# EAGLE design 10_ARDUINO (EAGLE 7.6.0)
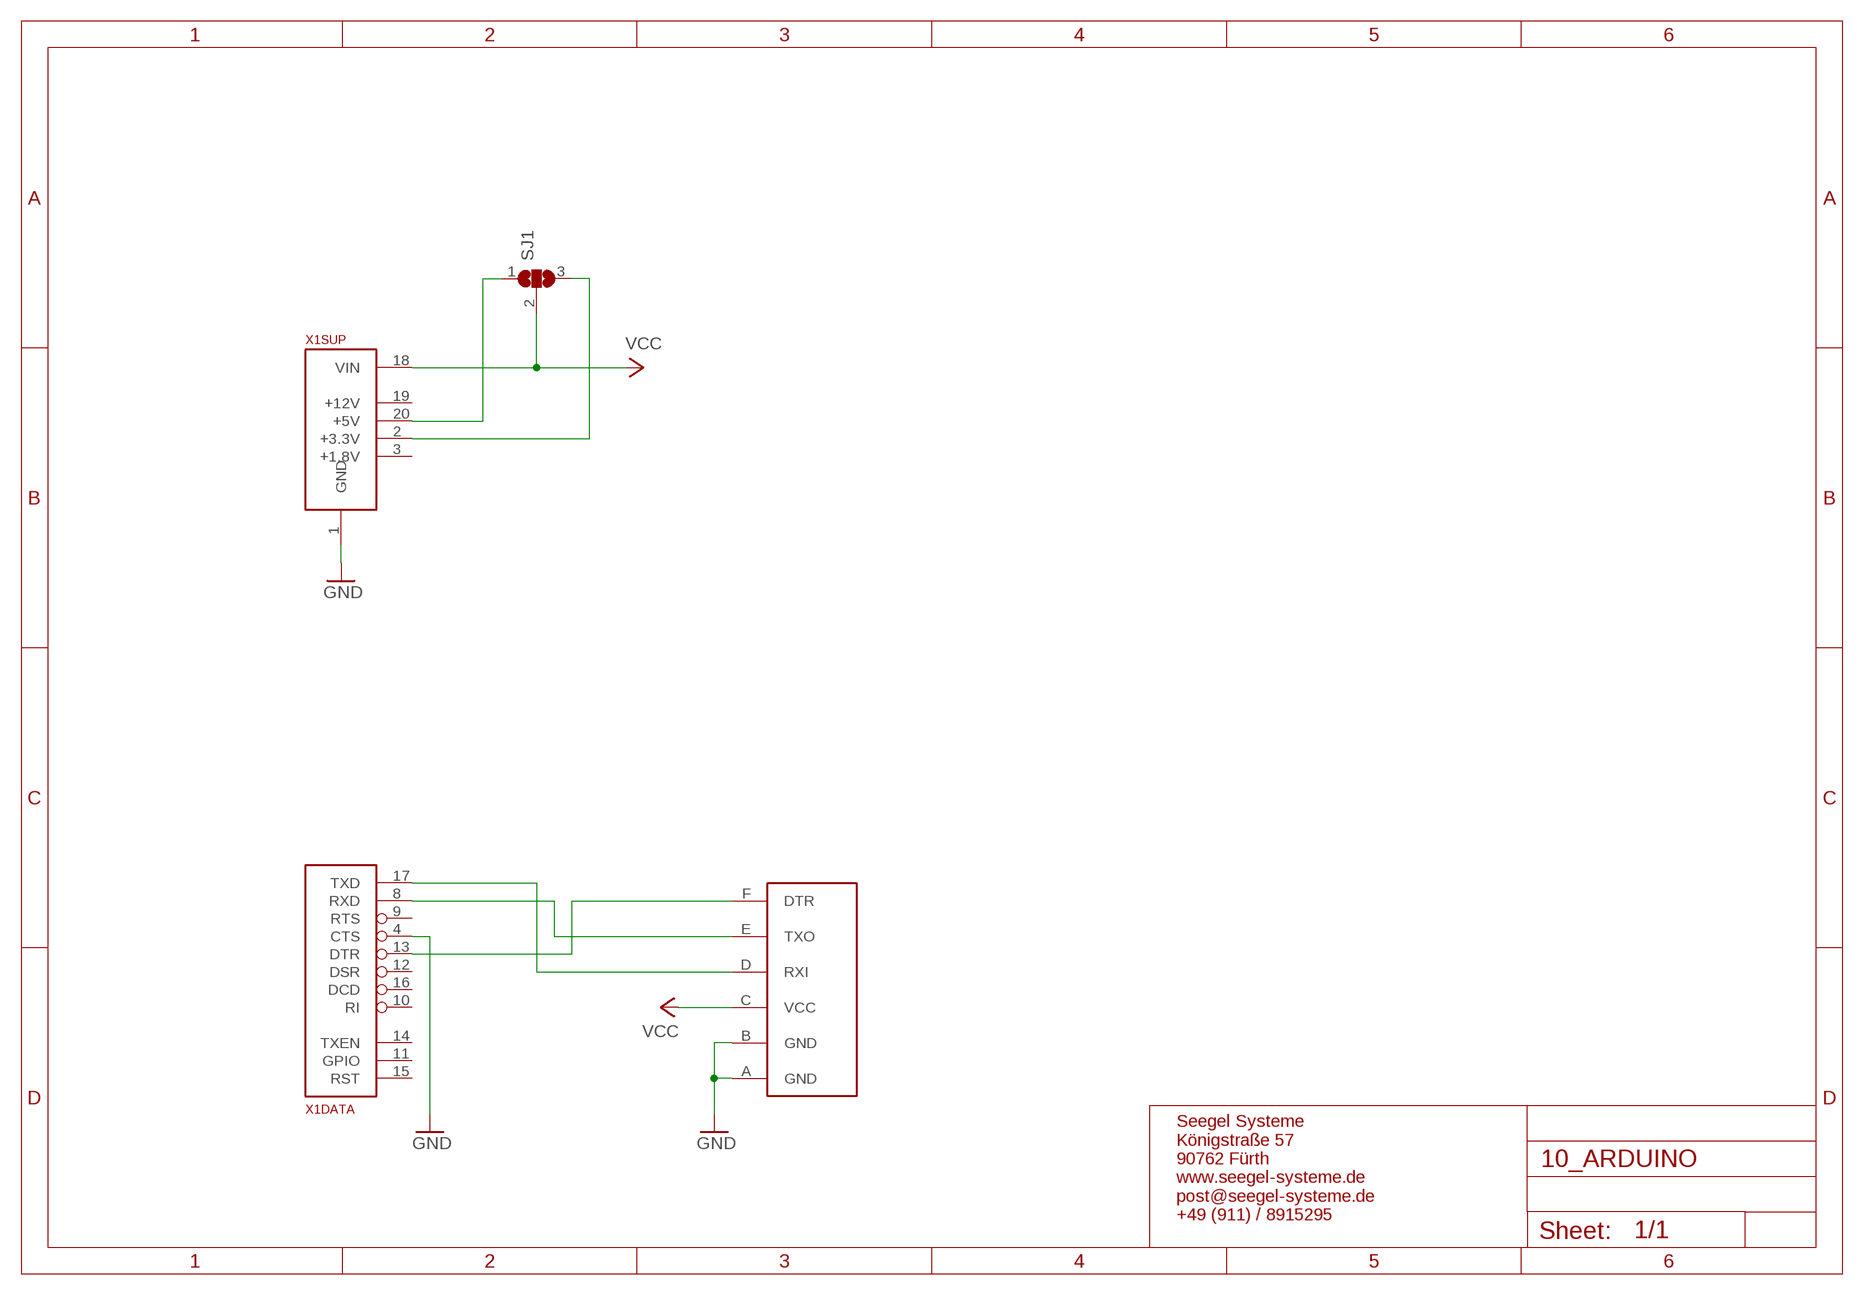
[diagram p0: schematic, sheet 1]

## Parts
M1  ARDUINO_PROMINI  [ARDUINO_PROMINI]
SJ1  SJ2W  [SJ_2]
X1  ALLSERIALSLAVE  [DAUGHTER-THT]

## Nets
GND: M1.A(GND) M1.B(GND) X1.1(SUP:GND) X1.4(DATA:CTS)
N$1: M1.D(RXI) X1.17(DATA:TXD)
N$2: M1.E(TXO) X1.8(DATA:RXD)
N$11: M1.F(DTR) X1.13(DATA:DTR)
N$279: SJ1.3 X1.2(SUP:+3.3V)
N$280: SJ1.1 X1.20(SUP:+5V)
VCC: M1.C(VCC) SJ1.2 X1.18(SUP:VIN)
Unconnected: X1.3(SUP:+1.8V) X1.5(USB:D-) X1.6(USB:D+) X1.7(USB:VUSB) X1.9(DATA:RTS) X1.10(DATA:RI) X1.11(DATA:GPIO) X1.12(DATA:DSR) X1.14(DATA:TXEN) X1.15(DATA:RST) X1.16(DATA:DCD) X1.19(SUP:+12V)

## Notes on the sheet
- Seegel Systeme
  Königstraße 57
  90762 Fürth
  www.seegel-systeme.de
  post@seegel-systeme.de
  +49 (911) / 8915295

## Library data of the parts
M1 = SeeSys:ARDUINO_PROMINI
SJ1 = jumper:SJ2W: SMD solder JUMPER
X1 = AllSerialv2:ALLSERIALSLAVE

## Board
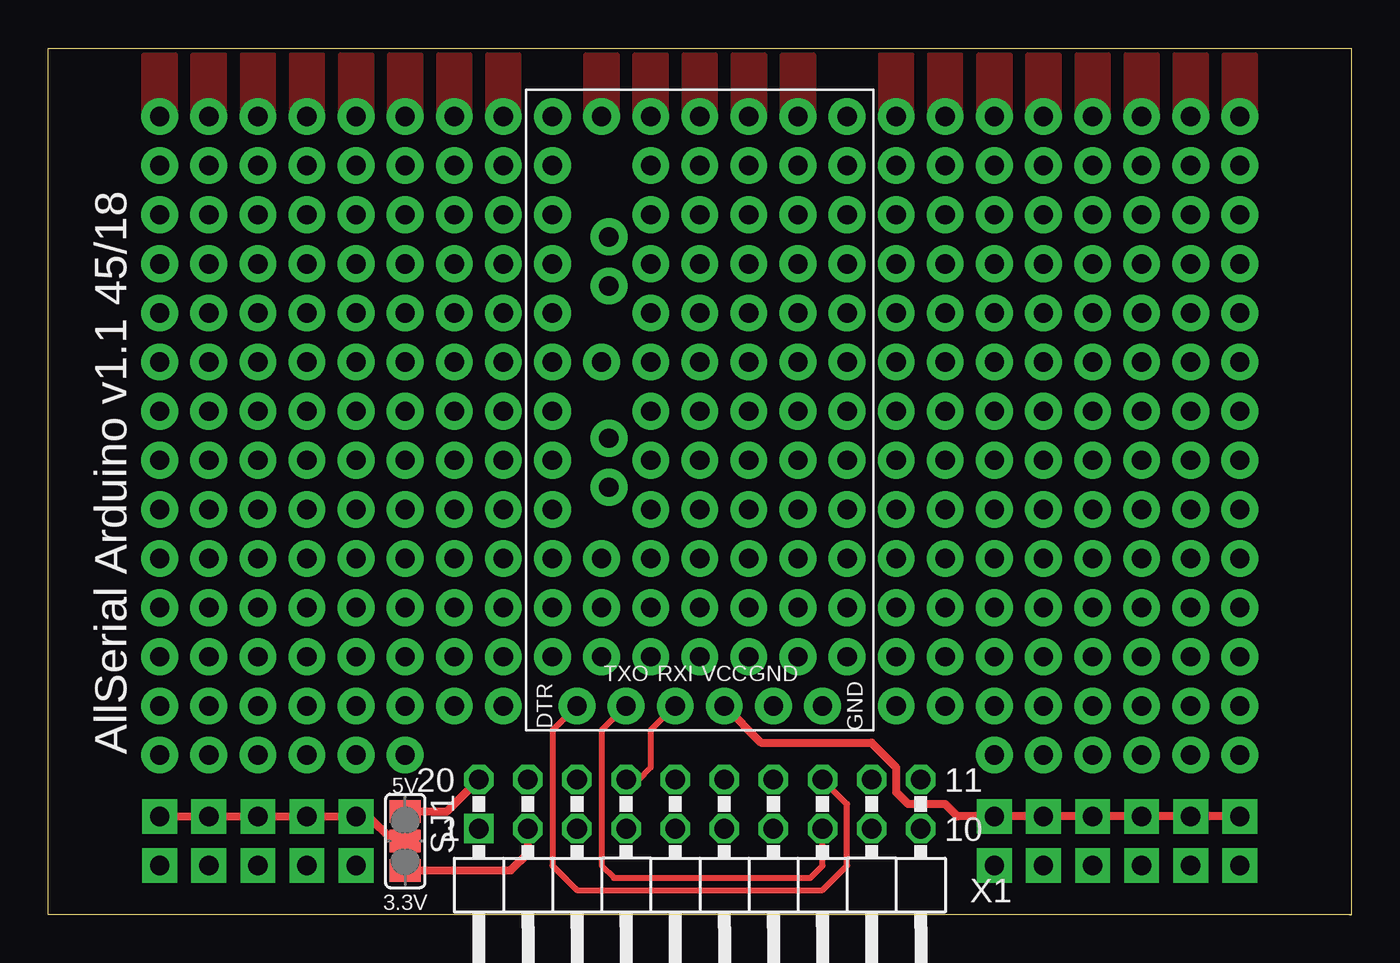
[diagram p1: board, top side]
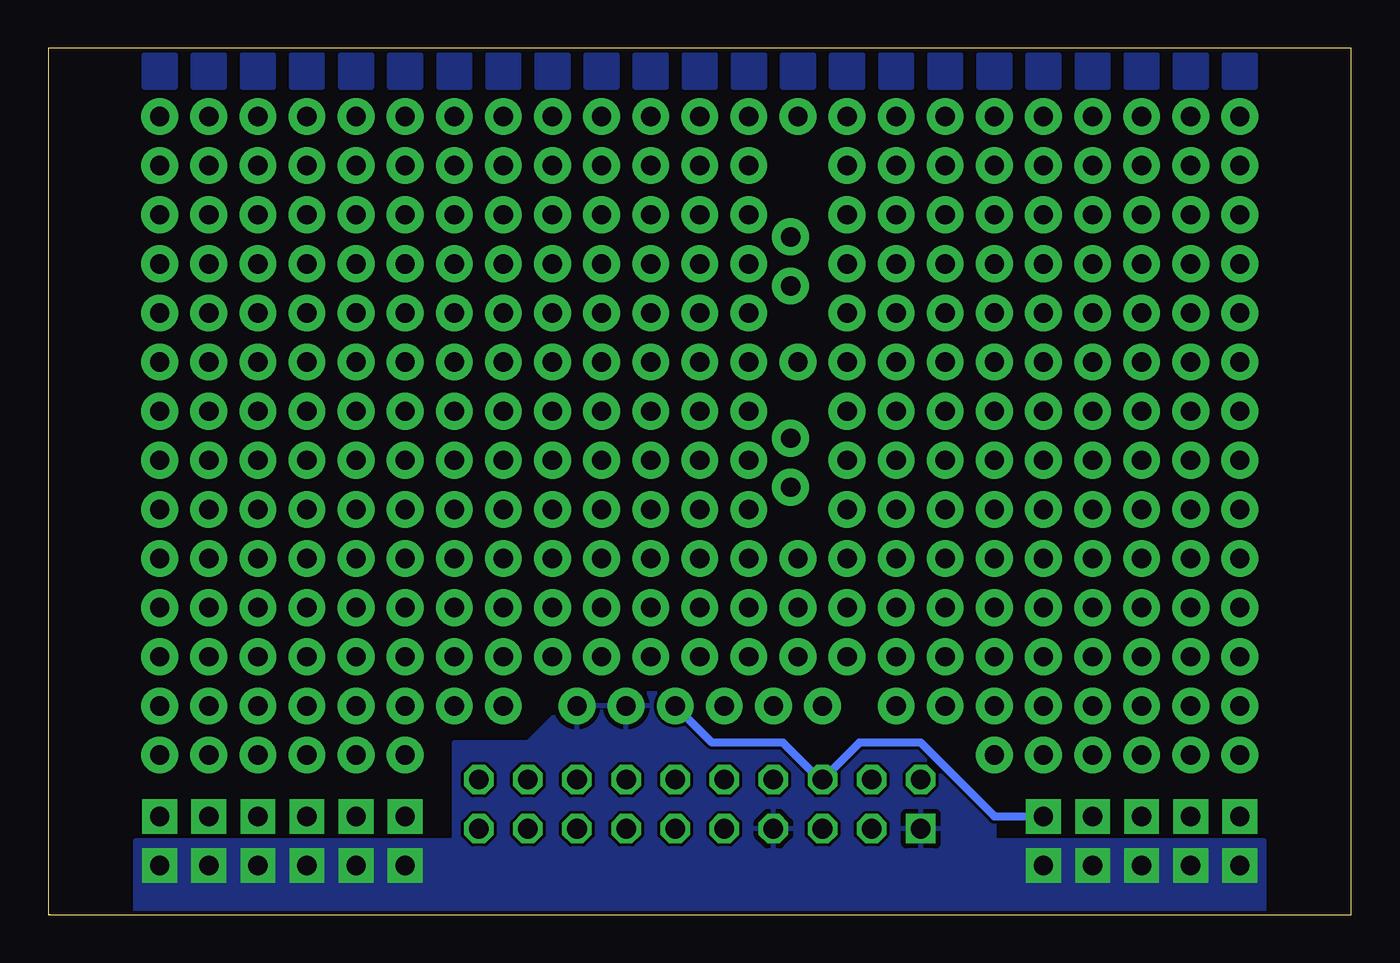
[diagram p2: board, bottom side, seen from below]

Size 67.4 x 44.8 mm. Coordinates in mm from the lower left corner, seen from the top.
Outline: 67.31,0 67.4,0
Copper layers (1*16): Top 0.035mm / dielectric 1.6mm / Bottom 0.035mm
Design rules "Elecrow_2-layer_PCB_eagle_rule *": minimum track width 6mil, minimum drill 12mil, track to track 6mil, track to pad 6mil, pad to pad 6mil, via to via 8mil, smd to smd 0mil, copper to edge 0.2mm, drill to drill 10mil, minimum pad ring 6mil, minimum via ring 6mil, stop-mask expansion 0mil, vias tented up to drill 100mil, thermal gap 10mil

### Footprints (pad centres in the part's own frame; a part is rotated, then mirrored left to right if it is on the bottom)
ARDUINO_PROMINI = drill 1 pad 1.9: A -6.35,30.48; B -3.81,30.48; C -1.27,30.48; D 1.27,30.48; E 3.81,30.48; F 6.35,30.48; P$1 -7.62,0; P$2 -7.62,2.54; P$3 -7.62,5.08; P$4 -7.62,7.62; P$5 -7.62,10.16; P$6 -7.62,12.7; P$7 -7.62,15.24; P$8 -7.62,17.78; P$9 -7.62,20.32; P$10 -7.62,22.86; P$11 -7.62,25.4; P$12 -7.62,27.94; P$13 7.62,0; P$14 7.62,2.54; P$15 7.62,5.08; P$16 7.62,7.62; P$17 7.62,10.16; P$18 7.62,12.7; P$19 7.62,15.24; P$20 7.62,17.78; P$21 7.62,20.32; P$22 7.62,22.86; P$23 7.62,25.4; P$24 7.62,27.94; P$25 4.699,6.223; P$26 4.699,8.763; P$27 4.699,16.637; P$28 4.699,19.177
SJ_2 = smd 1.168 x 1.6: 1 -1.524,0; 2 0,0; 3 1.524,0
DAUGHTER-THT = drill 1.016 square: 1 -11.43,4.445 | drill 1.016 octagon: 2 -8.89,4.445; 3 -6.35,4.445; 4 -3.81,4.445; 5 -1.27,4.445; 6 1.27,4.445; 7 3.81,4.445; 8 6.35,4.445; 9 8.89,4.445; 10 11.43,4.445; 11 11.43,6.985; 12 8.89,6.985; 13 6.35,6.985; 14 3.81,6.985; 15 1.27,6.985; 16 -1.27,6.985; 17 -3.81,6.985; 18 -6.35,6.985; 19 -8.89,6.985; 20 -11.43,6.985

### Placement (x,y rotation side)
M1  33.7,41.27 180 top
SJ1  18.46,3.81 270 top
X1  33.7,0 0 top

### Tracks (layer width: path | path; a pad name or v marks a point on that pad's centre or on a via)
GND  (via drill 1 pad 1.8)
  other vias: 5.76,2.54 8.3,2.54 10.84,2.54 13.38,2.54 15.92,2.54 48.94,2.54 51.48,2.54 54.02,2.54 56.56,2.54 59.1,2.54 61.64,2.54
  pour Bottom: 18.46,8.89 24.81,8.89 27.35,11.43 40.05,11.43 42.59,8.89 46.4,8.89 46.4,3.81 62.91,3.81 62.91,0 4.49,0 4.49,3.81 18.46,3.81
N$1
  Top 0.305: X1.17 30.53,6.99 31.16,7.62 31.16,9.53 M1.D
N$2
  Top 0.305: M1.E 28.62,9.53 28.62,2.54 29.26,1.91 39.42,1.91 40.05,2.54 X1.8
N$3  (via drill 1 pad 1.9)
  other vias: 23.54,41.27
  pour Top: 24.36,41.27 24.36,44.45 22.72,44.45 22.72,41.27
N$4  (via drill 1 pad 1.9)
  other vias: 21,41.27
  pour Top: 21.82,41.27 21.82,44.45 20.18,44.45 20.18,41.27
N$5  (via drill 1 pad 1.9)
  other vias: 18.46,41.27
  pour Top: 19.28,41.27 19.28,44.45 17.64,44.45 17.64,41.27
N$6  (via drill 1 pad 1.9)
  other vias: 15.92,41.27
  pour Top: 16.74,41.27 16.74,44.45 15.1,44.45 15.1,41.27
N$7  (via drill 1 pad 1.9)
  other vias: 13.38,41.27
  pour Top: 14.2,41.27 14.2,44.45 12.56,44.45 12.56,41.27
N$8  (via drill 1 pad 1.9)
  other vias: 10.84,41.27
  pour Top: 11.66,41.27 11.66,44.45 10.02,44.45 10.02,41.27
N$9  (via drill 1 pad 1.9)
  other vias: 8.3,41.27
  pour Top: 9.12,41.27 9.12,44.45 7.48,44.45 7.48,41.27
N$10  (via drill 1 pad 1.9)
  other vias: 5.76,41.27
  pour Top: 6.58,41.27 6.58,44.45 4.94,44.45 4.94,41.27
N$11
  Top 0.305: M1.F 26.08,9.53 26.08,2.54 27.35,1.27 40.05,1.27 41.32,2.54 41.32,5.71 X1.13
N$12  (via drill 1 pad 1.9)
  other vias: 23.54,38.73
N$13  (via drill 1 pad 1.9)
  other vias: 21,38.73
N$14  (via drill 1 pad 1.9)
  other vias: 18.46,38.73
N$15  (via drill 1 pad 1.9)
  other vias: 15.92,38.73
N$16  (via drill 1 pad 1.9)
  other vias: 13.38,38.73
N$17  (via drill 1 pad 1.9)
  other vias: 10.84,38.73
N$18  (via drill 1 pad 1.9)
  other vias: 8.3,38.73
N$19  (via drill 1 pad 1.9)
  other vias: 5.76,38.73
N$20  (via drill 1 pad 1.9)
  other vias: 23.54,36.2
N$21  (via drill 1 pad 1.9)
  other vias: 21,36.2
N$22  (via drill 1 pad 1.9)
  other vias: 18.46,36.2
N$23  (via drill 1 pad 1.9)
  other vias: 15.92,36.2
N$24  (via drill 1 pad 1.9)
  other vias: 13.38,36.2
N$25  (via drill 1 pad 1.9)
  other vias: 10.84,36.2
N$26  (via drill 1 pad 1.9)
  other vias: 8.3,36.2
N$27  (via drill 1 pad 1.9)
  other vias: 5.76,36.2
N$28  (via drill 1 pad 1.9)
  other vias: 23.54,33.66
N$29  (via drill 1 pad 1.9)
  other vias: 21,33.66
N$30  (via drill 1 pad 1.9)
  other vias: 18.46,33.66
N$31  (via drill 1 pad 1.9)
  other vias: 15.92,33.66
N$32  (via drill 1 pad 1.9)
  other vias: 13.38,33.66
N$33  (via drill 1 pad 1.9)
  other vias: 10.84,33.66
N$34  (via drill 1 pad 1.9)
  other vias: 8.3,33.66
N$35  (via drill 1 pad 1.9)
  other vias: 5.76,33.66
N$36  (via drill 1 pad 1.9)
  other vias: 23.54,31.11
N$37  (via drill 1 pad 1.9)
  other vias: 21,31.11
N$38  (via drill 1 pad 1.9)
  other vias: 18.46,31.11
N$39  (via drill 1 pad 1.9)
  other vias: 15.92,31.11
N$40  (via drill 1 pad 1.9)
  other vias: 13.38,31.11
N$41  (via drill 1 pad 1.9)
  other vias: 10.84,31.11
N$42  (via drill 1 pad 1.9)
  other vias: 8.3,31.11
N$43  (via drill 1 pad 1.9)
  other vias: 5.76,31.11
N$44  (via drill 1 pad 1.9)
  other vias: 23.54,28.57
N$45  (via drill 1 pad 1.9)
  other vias: 21,28.57
N$46  (via drill 1 pad 1.9)
  other vias: 18.46,28.57
N$47  (via drill 1 pad 1.9)
  other vias: 15.92,28.57
N$48  (via drill 1 pad 1.9)
  other vias: 13.38,28.57
N$49  (via drill 1 pad 1.9)
  other vias: 10.84,28.57
N$50  (via drill 1 pad 1.9)
  other vias: 8.3,28.57
N$51  (via drill 1 pad 1.9)
  other vias: 5.76,28.57
N$52  (via drill 1 pad 1.9)
  other vias: 23.54,26.04
N$53  (via drill 1 pad 1.9)
  other vias: 21,26.04
N$54  (via drill 1 pad 1.9)
  other vias: 18.46,26.04
N$55  (via drill 1 pad 1.9)
  other vias: 15.92,26.04
N$56  (via drill 1 pad 1.9)
  other vias: 13.38,26.04
N$57  (via drill 1 pad 1.9)
  other vias: 10.84,26.04
N$58  (via drill 1 pad 1.9)
  other vias: 8.3,26.04
N$59  (via drill 1 pad 1.9)
  other vias: 5.76,26.04
N$60  (via drill 1 pad 1.9)
  other vias: 23.54,23.5
N$61  (via drill 1 pad 1.9)
  other vias: 21,23.5
N$62  (via drill 1 pad 1.9)
  other vias: 18.46,23.5
N$63  (via drill 1 pad 1.9)
  other vias: 15.92,23.5
N$64  (via drill 1 pad 1.9)
  other vias: 13.38,23.5
N$65  (via drill 1 pad 1.9)
  other vias: 10.84,23.5
N$66  (via drill 1 pad 1.9)
  other vias: 8.3,23.5
N$67  (via drill 1 pad 1.9)
  other vias: 5.76,23.5
N$68  (via drill 1 pad 1.9)
  other vias: 23.54,20.95
N$69  (via drill 1 pad 1.9)
  other vias: 21,20.95
N$70  (via drill 1 pad 1.9)
  other vias: 18.46,20.95
N$71  (via drill 1 pad 1.9)
  other vias: 15.92,20.95
N$72  (via drill 1 pad 1.9)
  other vias: 13.38,20.95
N$73  (via drill 1 pad 1.9)
  other vias: 10.84,20.95
N$74  (via drill 1 pad 1.9)
  other vias: 8.3,20.95
N$75  (via drill 1 pad 1.9)
  other vias: 5.76,20.95
N$76  (via drill 1 pad 1.9)
  other vias: 23.54,18.41
N$77  (via drill 1 pad 1.9)
  other vias: 21,18.41
N$78  (via drill 1 pad 1.9)
  other vias: 18.46,18.41
N$79  (via drill 1 pad 1.9)
  other vias: 15.92,18.41
N$80  (via drill 1 pad 1.9)
  other vias: 13.38,18.41
N$81  (via drill 1 pad 1.9)
  other vias: 10.84,18.41
N$82  (via drill 1 pad 1.9)
  other vias: 8.3,18.41
N$83  (via drill 1 pad 1.9)
  other vias: 5.76,18.41
N$84  (via drill 1 pad 1.9)
  other vias: 23.54,15.88
N$85  (via drill 1 pad 1.9)
  other vias: 21,15.88
N$86  (via drill 1 pad 1.9)
  other vias: 18.46,15.88
N$87  (via drill 1 pad 1.9)
  other vias: 15.92,15.88
N$88  (via drill 1 pad 1.9)
  other vias: 13.38,15.88
N$89  (via drill 1 pad 1.9)
  other vias: 10.84,15.88
N$90  (via drill 1 pad 1.9)
  other vias: 8.3,15.88
N$91  (via drill 1 pad 1.9)
  other vias: 5.76,15.88
N$92  (via drill 1 pad 1.9)
  other vias: 23.54,13.34
N$93  (via drill 1 pad 1.9)
  other vias: 21,13.34
N$94  (via drill 1 pad 1.9)
  other vias: 18.46,13.34
N$95  (via drill 1 pad 1.9)
  other vias: 15.92,13.34
N$96  (via drill 1 pad 1.9)
  other vias: 13.38,13.34
N$97  (via drill 1 pad 1.9)
  other vias: 10.84,13.34
N$98  (via drill 1 pad 1.9)
  other vias: 8.3,13.34
N$99  (via drill 1 pad 1.9)
  other vias: 5.76,13.34
N$100  (via drill 1 pad 1.9)
  other vias: 61.64,41.27
  pour Top: 62.46,41.27 62.46,44.45 60.82,44.45 60.82,41.27
N$101  (via drill 1 pad 1.9)
  other vias: 59.1,41.27
  pour Top: 59.92,41.27 59.92,44.45 58.28,44.45 58.28,41.27
N$102  (via drill 1 pad 1.9)
  other vias: 56.56,41.27
  pour Top: 57.38,41.27 57.38,44.45 55.74,44.45 55.74,41.27
N$103  (via drill 1 pad 1.9)
  other vias: 54.02,41.27
  pour Top: 54.84,41.27 54.84,44.45 53.2,44.45 53.2,41.27
N$104  (via drill 1 pad 1.9)
  other vias: 51.48,41.27
  pour Top: 52.3,41.27 52.3,44.45 50.66,44.45 50.66,41.27
N$105  (via drill 1 pad 1.9)
  other vias: 48.94,41.27
  pour Top: 49.76,41.27 49.76,44.45 48.12,44.45 48.12,41.27
N$106  (via drill 1 pad 1.9)
  other vias: 46.4,41.27
  pour Top: 47.22,41.27 47.22,44.45 45.58,44.45 45.58,41.27
N$107  (via drill 1 pad 1.9)
  other vias: 43.86,41.27
  pour Top: 44.68,41.27 44.68,44.45 43.04,44.45 43.04,41.27
N$108  (via drill 1 pad 1.9)
  other vias: 61.64,38.73
N$109  (via drill 1 pad 1.9)
  other vias: 59.1,38.73
N$110  (via drill 1 pad 1.9)
  other vias: 56.56,38.73
N$111  (via drill 1 pad 1.9)
  other vias: 54.02,38.73
N$112  (via drill 1 pad 1.9)
  other vias: 51.48,38.73
N$113  (via drill 1 pad 1.9)
  other vias: 48.94,38.73
N$114  (via drill 1 pad 1.9)
  other vias: 46.4,38.73
N$115  (via drill 1 pad 1.9)
  other vias: 43.86,38.73
N$116  (via drill 1 pad 1.9)
  other vias: 61.64,36.2
N$117  (via drill 1 pad 1.9)
  other vias: 59.1,36.2
N$118  (via drill 1 pad 1.9)
  other vias: 56.56,36.2
N$119  (via drill 1 pad 1.9)
  other vias: 54.02,36.2
N$120  (via drill 1 pad 1.9)
  other vias: 51.48,36.2
N$121  (via drill 1 pad 1.9)
  other vias: 48.94,36.2
N$122  (via drill 1 pad 1.9)
  other vias: 46.4,36.2
N$123  (via drill 1 pad 1.9)
  other vias: 43.86,36.2
N$124  (via drill 1 pad 1.9)
  other vias: 61.64,33.66
N$125  (via drill 1 pad 1.9)
  other vias: 59.1,33.66
N$126  (via drill 1 pad 1.9)
  other vias: 56.56,33.66
N$127  (via drill 1 pad 1.9)
  other vias: 54.02,33.66
N$128  (via drill 1 pad 1.9)
  other vias: 51.48,33.66
N$129  (via drill 1 pad 1.9)
  other vias: 48.94,33.66
N$130  (via drill 1 pad 1.9)
  other vias: 46.4,33.66
N$131  (via drill 1 pad 1.9)
  other vias: 43.86,33.66
N$132  (via drill 1 pad 1.9)
  other vias: 61.64,31.11
N$133  (via drill 1 pad 1.9)
  other vias: 59.1,31.11
N$134  (via drill 1 pad 1.9)
  other vias: 56.56,31.11
N$135  (via drill 1 pad 1.9)
  other vias: 54.02,31.11
N$136  (via drill 1 pad 1.9)
  other vias: 51.48,31.11
N$137  (via drill 1 pad 1.9)
  other vias: 48.94,31.11
N$138  (via drill 1 pad 1.9)
  other vias: 46.4,31.11
N$139  (via drill 1 pad 1.9)
  other vias: 43.86,31.11
N$140  (via drill 1 pad 1.9)
  other vias: 61.64,28.57
N$141  (via drill 1 pad 1.9)
  other vias: 59.1,28.57
N$142  (via drill 1 pad 1.9)
  other vias: 56.56,28.57
N$143  (via drill 1 pad 1.9)
  other vias: 54.02,28.57
N$144  (via drill 1 pad 1.9)
  other vias: 51.48,28.57
N$145  (via drill 1 pad 1.9)
  other vias: 48.94,28.57
N$146  (via drill 1 pad 1.9)
  other vias: 46.4,28.57
N$147  (via drill 1 pad 1.9)
  other vias: 43.86,28.57
N$148  (via drill 1 pad 1.9)
  other vias: 61.64,26.04
N$149  (via drill 1 pad 1.9)
  other vias: 59.1,26.04
N$150  (via drill 1 pad 1.9)
  other vias: 56.56,26.04
N$151  (via drill 1 pad 1.9)
  other vias: 54.02,26.04
N$152  (via drill 1 pad 1.9)
  other vias: 51.48,26.04
N$153  (via drill 1 pad 1.9)
  other vias: 48.94,26.04
N$154  (via drill 1 pad 1.9)
  other vias: 46.4,26.04
N$155  (via drill 1 pad 1.9)
  other vias: 43.86,26.04
N$156  (via drill 1 pad 1.9)
  other vias: 61.64,23.5
N$157  (via drill 1 pad 1.9)
  other vias: 59.1,23.5
N$158  (via drill 1 pad 1.9)
  other vias: 56.56,23.5
N$159  (via drill 1 pad 1.9)
  other vias: 54.02,23.5
N$160  (via drill 1 pad 1.9)
  other vias: 51.48,23.5
N$161  (via drill 1 pad 1.9)
  other vias: 48.94,23.5
N$162  (via drill 1 pad 1.9)
  other vias: 46.4,23.5
N$163  (via drill 1 pad 1.9)
  other vias: 43.86,23.5
N$164  (via drill 1 pad 1.9)
  other vias: 61.64,20.95
N$165  (via drill 1 pad 1.9)
  other vias: 59.1,20.95
N$166  (via drill 1 pad 1.9)
  other vias: 56.56,20.95
N$167  (via drill 1 pad 1.9)
  other vias: 54.02,20.95
N$168  (via drill 1 pad 1.9)
  other vias: 51.48,20.95
N$169  (via drill 1 pad 1.9)
  other vias: 48.94,20.95
N$170  (via drill 1 pad 1.9)
  other vias: 46.4,20.95
N$171  (via drill 1 pad 1.9)
  other vias: 43.86,20.95
N$172  (via drill 1 pad 1.9)
  other vias: 61.64,18.41
N$173  (via drill 1 pad 1.9)
  other vias: 59.1,18.41
N$174  (via drill 1 pad 1.9)
  other vias: 56.56,18.41
N$175  (via drill 1 pad 1.9)
  other vias: 54.02,18.41
N$176  (via drill 1 pad 1.9)
  other vias: 51.48,18.41
N$177  (via drill 1 pad 1.9)
  other vias: 48.94,18.41
N$178  (via drill 1 pad 1.9)
  other vias: 46.4,18.41
N$179  (via drill 1 pad 1.9)
  other vias: 43.86,18.41
N$180  (via drill 1 pad 1.9)
  other vias: 61.64,15.88
N$181  (via drill 1 pad 1.9)
  other vias: 59.1,15.88
N$182  (via drill 1 pad 1.9)
  other vias: 56.56,15.88
N$183  (via drill 1 pad 1.9)
  other vias: 54.02,15.88
N$184  (via drill 1 pad 1.9)
  other vias: 51.48,15.88
N$185  (via drill 1 pad 1.9)
  other vias: 48.94,15.88
N$186  (via drill 1 pad 1.9)
  other vias: 46.4,15.88
N$187  (via drill 1 pad 1.9)
  other vias: 43.86,15.88
N$188  (via drill 1 pad 1.9)
  other vias: 61.64,13.34
N$189  (via drill 1 pad 1.9)
  other vias: 59.1,13.34
N$190  (via drill 1 pad 1.9)
  other vias: 56.56,13.34
N$191  (via drill 1 pad 1.9)
  other vias: 54.02,13.34
N$192  (via drill 1 pad 1.9)
  other vias: 51.48,13.34
N$193  (via drill 1 pad 1.9)
  other vias: 48.94,13.34
N$194  (via drill 1 pad 1.9)
  other vias: 46.4,13.34
N$195  (via drill 1 pad 1.9)
  other vias: 43.86,13.34
N$196  (via drill 1 pad 1.9)
  other vias: 38.78,38.73
N$197  (via drill 1 pad 1.9)
  other vias: 38.78,36.2
N$198  (via drill 1 pad 1.9)
  other vias: 38.78,33.66
N$199  (via drill 1 pad 1.9)
  other vias: 38.78,31.11
N$200  (via drill 1 pad 1.9)
  other vias: 38.78,28.57
N$201  (via drill 1 pad 1.9)
  other vias: 38.78,26.04
N$202  (via drill 1 pad 1.9)
  other vias: 38.78,23.5
N$203  (via drill 1 pad 1.9)
  other vias: 38.78,20.95
N$204  (via drill 1 pad 1.9)
  other vias: 38.78,18.41
N$205  (via drill 1 pad 1.9)
  other vias: 38.78,15.88
N$206  (via drill 1 pad 1.9)
  other vias: 38.78,13.34
N$207  (via drill 1 pad 1.9)
  other vias: 36.24,38.73
N$208  (via drill 1 pad 1.9)
  other vias: 36.24,36.2
N$209  (via drill 1 pad 1.9)
  other vias: 36.24,33.66
N$210  (via drill 1 pad 1.9)
  other vias: 36.24,31.11
N$211  (via drill 1 pad 1.9)
  other vias: 36.24,28.57
N$212  (via drill 1 pad 1.9)
  other vias: 36.24,26.04
N$213  (via drill 1 pad 1.9)
  other vias: 36.24,23.5
N$214  (via drill 1 pad 1.9)
  other vias: 36.24,20.95
N$215  (via drill 1 pad 1.9)
  other vias: 36.24,18.41
N$216  (via drill 1 pad 1.9)
  other vias: 36.24,15.88
N$217  (via drill 1 pad 1.9)
  other vias: 36.24,13.34
N$218  (via drill 1 pad 1.9)
  other vias: 31.16,36.2
N$219  (via drill 1 pad 1.9)
  other vias: 33.7,36.2
N$220  (via drill 1 pad 1.9)
  other vias: 31.16,33.66
N$221  (via drill 1 pad 1.9)
  other vias: 33.7,31.11
N$222  (via drill 1 pad 1.9)
  other vias: 33.7,28.57
N$223  (via drill 1 pad 1.9)
  other vias: 33.7,26.04
N$224  (via drill 1 pad 1.9)
  other vias: 33.7,23.5
N$225  (via drill 1 pad 1.9)
  other vias: 33.7,20.95
N$226  (via drill 1 pad 1.9)
  other vias: 33.7,18.41
N$227  (via drill 1 pad 1.9)
  other vias: 33.7,15.88
N$228  (via drill 1 pad 1.9)
  other vias: 33.7,13.34
N$229  (via drill 1 pad 1.9)
  other vias: 23.54,10.79
N$230  (via drill 1 pad 1.9)
  other vias: 21,10.79
N$231  (via drill 1 pad 1.9)
  other vias: 18.46,10.79
N$232  (via drill 1 pad 1.9)
  other vias: 15.92,10.79
N$233  (via drill 1 pad 1.9)
  other vias: 13.38,10.79
N$234  (via drill 1 pad 1.9)
  other vias: 10.84,10.79
N$235  (via drill 1 pad 1.9)
  other vias: 8.3,10.79
N$236  (via drill 1 pad 1.9)
  other vias: 5.76,10.79
N$237  (via drill 1 pad 1.9)
  other vias: 61.64,10.79
N$238  (via drill 1 pad 1.9)
  other vias: 59.1,10.79
N$239  (via drill 1 pad 1.9)
  other vias: 56.56,10.79
N$240  (via drill 1 pad 1.9)
  other vias: 54.02,10.79
N$241  (via drill 1 pad 1.9)
  other vias: 51.48,10.79
N$242  (via drill 1 pad 1.9)
  other vias: 48.94,10.79
N$243  (via drill 1 pad 1.9)
  other vias: 46.4,10.79
N$244  (via drill 1 pad 1.9)
  other vias: 43.86,10.79
N$245
  pour Bottom: 4.94,42.8 4.94,44.45 6.58,44.45 6.58,42.8
N$246
  pour Bottom: 7.48,42.8 7.48,44.45 9.12,44.45 9.12,42.8
N$247
  pour Bottom: 10.02,42.8 10.02,44.45 11.66,44.45 11.66,42.8
N$248
  pour Bottom: 12.56,42.8 12.56,44.45 14.2,44.45 14.2,42.8
N$249
  pour Bottom: 15.1,42.8 15.1,44.45 16.74,44.45 16.74,42.8
N$250
  pour Bottom: 17.64,42.8 17.64,44.45 19.28,44.45 19.28,42.8
N$251
  pour Bottom: 20.18,42.8 20.18,44.45 21.82,44.45 21.82,42.8
N$252
  pour Bottom: 22.72,42.8 22.72,44.45 24.36,44.45 24.36,42.8
N$253
  pour Bottom: 43.04,42.8 43.04,44.45 44.68,44.45 44.68,42.8
N$254
  pour Bottom: 45.58,42.8 45.58,44.45 47.22,44.45 47.22,42.8
N$255
  pour Bottom: 48.12,42.8 48.12,44.45 49.76,44.45 49.76,42.8
N$256
  pour Bottom: 50.66,42.8 50.66,44.45 52.3,44.45 52.3,42.8
N$257
  pour Bottom: 53.2,42.8 53.2,44.45 54.84,44.45 54.84,42.8
N$258
  pour Bottom: 55.74,42.8 55.74,44.45 57.38,44.45 57.38,42.8
N$259
  pour Bottom: 58.28,42.8 58.28,44.45 59.92,44.45 59.92,42.8
N$260
  pour Bottom: 60.82,42.8 60.82,44.45 62.46,44.45 62.46,42.8
N$261  (via drill 1 pad 1.9)
  other vias: 33.7,33.66
N$262  (via drill 1 pad 1.9)
  other vias: 31.16,31.11
N$263  (via drill 1 pad 1.9)
  other vias: 31.16,28.57
N$264  (via drill 1 pad 1.9)
  other vias: 31.16,26.04
N$265  (via drill 1 pad 1.9)
  other vias: 31.16,23.5
N$266  (via drill 1 pad 1.9)
  other vias: 31.16,20.95
N$267  (via drill 1 pad 1.9)
  other vias: 31.16,18.41
N$268  (via drill 1 pad 1.9)
  other vias: 31.16,15.88
N$269  (via drill 1 pad 1.9)
  other vias: 31.16,13.34
N$270  (via drill 1 pad 1.9)
  other vias: 33.7,38.73
N$271  (via drill 1 pad 1.9)
  other vias: 31.16,38.73
N$272  (via drill 1 pad 1.9)
  other vias: 28.62,28.57
N$273  (via drill 1 pad 1.9)
  other vias: 28.62,18.41
N$274  (via drill 1 pad 1.9)
  other vias: 28.62,15.88
N$275  (via drill 1 pad 1.9)
  other vias: 28.62,13.34
N$276  (via drill 1 pad 1.9)
  other vias: 38.78,41.27
  pour Top: 39.6,41.27 39.6,44.45 37.96,44.45 37.96,41.27
N$277  (via drill 1 pad 1.9)
  other vias: 36.24,41.27
  pour Top: 37.06,41.27 37.06,44.45 35.42,44.45 35.42,41.27
N$278  (via drill 1 pad 1.9)
  other vias: 33.7,41.27
  pour Top: 34.52,41.27 34.52,44.45 32.88,44.45 32.88,41.27
N$279
  Top 0.406: SJ1.3 23.92,2.29 24.81,3.17 X1.2
N$280
  Top 0.406: SJ1.1 20.62,5.33 X1.20
N$281  (via drill 1 pad 1.9)
  other vias: 31.16,41.27
  pour Top: 31.98,41.27 31.98,44.45 30.34,44.45 30.34,41.27
N$282  (via drill 1 pad 1.9)
  other vias: 28.62,41.27
  pour Top: 29.44,41.27 29.44,44.45 27.8,44.45 27.8,41.27
N$283
  pour Bottom: 25.26,42.8 25.26,44.45 26.9,44.45 26.9,42.8
N$284
  pour Bottom: 27.8,42.8 27.8,44.45 29.44,44.45 29.44,42.8
N$285
  pour Bottom: 30.34,42.8 30.34,44.45 31.98,44.45 31.98,42.8
N$286
  pour Bottom: 32.88,42.8 32.88,44.45 34.52,44.45 34.52,42.8
N$287
  pour Bottom: 35.42,42.8 35.42,44.45 37.06,44.45 37.06,42.8
N$288
  pour Bottom: 37.96,42.8 37.96,44.45 39.6,44.45 39.6,42.8
N$289  (via drill 1 pad 1.9)
  other vias: 10.84,8.26
N$290  (via drill 1 pad 1.9)
  other vias: 13.38,8.26
N$291  (via drill 1 pad 1.9)
  other vias: 15.92,8.26
N$292
  pour Bottom: 40.5,42.8 40.5,44.45 42.14,44.45 42.14,42.8
N$293  (via drill 1 pad 1.9)
  other vias: 18.46,8.26
N$295  (via drill 1 pad 1.9)
  other vias: 5.76,8.26
N$296  (via drill 1 pad 1.9)
  other vias: 8.3,8.26
N$304  (via drill 1 pad 1.9)
  other vias: 48.94,8.26
N$305  (via drill 1 pad 1.9)
  other vias: 51.48,8.26
N$306  (via drill 1 pad 1.9)
  other vias: 54.02,8.26
N$307  (via drill 1 pad 1.9)
  other vias: 56.56,8.26
N$308  (via drill 1 pad 1.9)
  other vias: 59.1,8.26
N$309  (via drill 1 pad 1.9)
  other vias: 61.64,8.26
VCC  (via drill 1 pad 1.8)
  Top 0.406: v61.64,5.08 v59.1,5.08 v56.56,5.08 v54.02,5.08 v51.48,5.08 v48.94,5.08 47.04,5.08 46.4,5.71 44.5,5.71 43.86,6.35 43.86,7.62 42.59,8.89 36.88,8.89 M1.C | SJ1.2 17.83,3.81 16.56,5.08 v15.92,5.08 v13.38,5.08 v10.84,5.08 v5.76,5.08 v8.3,5.08
  Bottom 0.406: M1.C 33.07,8.89 29.38,8.89 27.48,6.99 X1.18 25.45,8.89 22.27,8.89 18.46,5.08 v15.92,5.08

### Text on the board
tPlace: AllSerial Arduino v1.1 45/18 | 5V | 3.3V